# Altium schematic sheet QTR-8A Array Sensor.SchDoc
size A; SheetNumber: 1; SheetTotal: 1
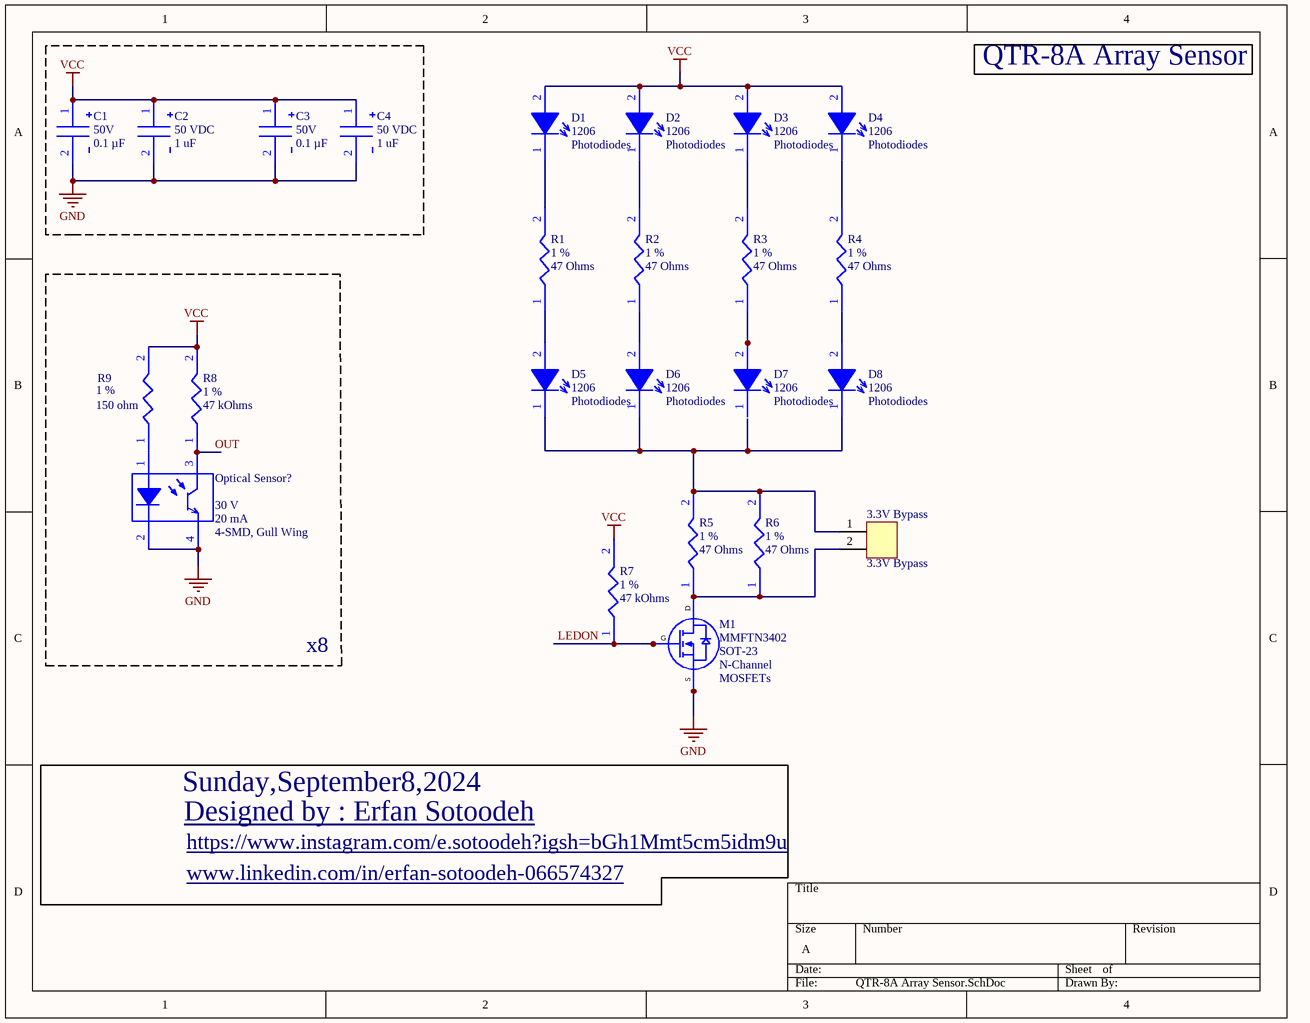
[diagram p0: QTR-8A Array Sensor.SchDoc]

## Parts
3.3V_Bypass  3.3V Bypass  [3.3V Bypass]
C1  Voltage - Rated: 50V  Capacitance: 0.1 µF  [CL21B104KBCNNNC]  (hidden comment: CL21B104KBCNNNC)
C2  Voltage - Rated: 50 VDC  Capacitance: 1 uF  [C1206X105K5RAC7800]  (hidden comment: C1206X105K5RAC)
C3  Voltage - Rated: 50V  Capacitance: 0.1 µF  [CL21B104KBCNNNC]  (hidden comment: CL21B104KBCNNNC)
C4  Voltage - Rated: 50 VDC  Capacitance: 1 uF  [C1206X105K5RAC7800]  (hidden comment: C1206X105K5RAC)
D1  Package/Case: 1206  Product: Photodiodes  [1541201EEA400]  (hidden comment: 1541201EEA400)
D2  Package/Case: 1206  Product: Photodiodes  [1541201EEA400]  (hidden comment: 1541201EEA400)
D3  Package/Case: 1206  Product: Photodiodes  [1541201EEA400]  (hidden comment: 1541201EEA400)
D4  Package/Case: 1206  Product: Photodiodes  [1541201EEA400]  (hidden comment: 1541201EEA400)
D5  Package/Case: 1206  Product: Photodiodes  [1541201EEA400]  (hidden comment: 1541201EEA400)
D6  Package/Case: 1206  Product: Photodiodes  [1541201EEA400]  (hidden comment: 1541201EEA400)
D7  Package/Case: 1206  Product: Photodiodes  [1541201EEA400]  (hidden comment: 1541201EEA400)
D8  Package/Case: 1206  Product: Photodiodes  [1541201EEA400]  (hidden comment: 1541201EEA400)
M1  MMFTN3402  Package/Case:: SOT-23  Transistor Polarity:: N-Channel  Product Category:: MOSFETs  [SOT95P245X110-3N]
Optical_Sensor?  Voltage - Collector Emitter Breakdown (Max: 30 V  Current - Collector (Ic) (Max): 20 mA  Package/Case:: 4-SMD, Gull Wing  [QRE1113GR]  (hidden comment: qre1113gr)
R1  Tolerance: 1 %  Resistance: 47 Ohms  [ERJ-S08F47R0V]  (hidden comment: ERJ-S08F47R0V)
R2  Tolerance: 1 %  Resistance: 47 Ohms  [ERJ-S08F47R0V]  (hidden comment: ERJ-S08F47R0V)
R3  Tolerance: 1 %  Resistance: 47 Ohms  [ERJ-S08F47R0V]  (hidden comment: ERJ-S08F47R0V)
R4  Tolerance: 1 %  Resistance: 47 Ohms  [ERJ-S08F47R0V]  (hidden comment: ERJ-S08F47R0V)
R5  Tolerance: 1 %  Resistance: 47 Ohms  [ERJ-S08F47R0V]  (hidden comment: ERJ-S08F47R0V)
R6  Tolerance: 1 %  Resistance: 47 Ohms  [ERJ-S08F47R0V]  (hidden comment: ERJ-S08F47R0V)
R7  Tolerance: 1 %  Resistance: 47 kOhms  [ERJ-U08F4702V]  (hidden comment: ERJ-U08F4702V)
R8  Tolerance: 1 %  Resistance: 47 kOhms  [ERJ-U08F4702V]  (hidden comment: ERJ-U08F4702V)
R9  Tolerance: 1 %  Resistance: 150 ohm  [ERJ-S08F47R0V]  (hidden comment: ERJ-8ENF1500V)

## Blocks framed on the sheet
x8: Optical_Sensor? R8 R9

## Nets
GND: C1.2 C2.2 C3.2 C4.2 M1.S Optical_Sensor?.2 Optical_Sensor?.4
VCC: C1.1(+) C2.1(+) C3.1(+) C4.1(+) D1.2 D2.2 D3.2 D4.2 R7.2 R8.2 R9.2
LEDON: M1.G R7.1
OUT: Optical_Sensor?.3 R8.1
Net3.3V_Bypass_1: 3.3V_Bypass.1 D5.1 D6.1 D8.1 R5.2 R6.2
Net3.3V_Bypass_2: 3.3V_Bypass.2 M1.D R5.1 R6.1
NetD1_1: D1.1 R1.2
NetD2_1: D2.1 R2.2
NetD3_1: D3.1 R3.2
NetD4_1: D4.1 R4.2
NetD5_2: D5.2 R1.1
NetD6_2: D6.2 R2.1
NetD7_2: D7.2 R3.1
NetD8_2: D8.2 R4.1
NetOptical_Sensor?_1: Optical_Sensor?.1 R9.1

Not connected (* = marked no-connect by the designer): D7 1; M1 1 2

## Notes on the sheet
- QTR-8A Array Sensor
- Sunday,September8,2024
- Designed by : Erfan Sotoodeh <https://www.instagram.com/e.sotoodeh?igsh=bGh1Mmt5cm5idm9u>
- https://www.instagram.com/e.sotoodeh?igsh=bGh1Mmt5cm5idm9u
- www.linkedin.com/in/erfan-sotoodeh-066574327 <http://www.linkedin.com/in/erfan-sotoodeh-066574327>

## Library data of the parts
C1 C3 = CL21B104KBCNNNC: 0.1 µF ±10% 50V Ceramic Capacitor X7R 0805 (2012 Metric); VALUE: 0.1 µF; Mounting Type: Surface Mount, MLCC; Package / Case: 0805
C2 C4 = C1206X105K5RAC: Multilayer Ceramic Capacitors MLCC - SMD/SMT 50V 1uF X7R 1206 10%; Mounting Type: Surface Mount Multilayer Ceramic Chip Capacitor; Package / Case: 1206; VALUE: 1 uF
D1-D8 = 1541201EEA400: Photodiodes WL-SDCB SMT Photodiode Chip Blk; Voltage: 32 V; Mounting Style: SMD/SMT
M1 = MMFTN3402: MOSFETs MOSFET, SOT-23, 30V, 4A, 150C, N; Mounting Style:: SMD/SMT; Number of Channels:: 1 Channel; Vgs: - 12 V, + 12 V; Subcategory:: Transistors; Id: 4 A; Vds: 30 V
Optical_Sensor? = qre1113gr: SENSOR OPTO TRANS REFL SMD PHOTO; Manufacturer: onsemi; Mounting Style:: SMD/SMT; Output Type: Phototransistor; Current - DC Forward (If) (Max): 50 mA; Category: Sensors, Transducers,Optical Sensors
R1-R6 = ERJ-S08F47R0V: Thick Film Resistors - SMD 1206 47ohms 1% Anti-Sulfur; Manufacturer:: Panasonic; Case: 1206; Mounting Style: PCB Mount; VALUE: 47 Ohms
R7 R8 = ERJ-U08F4702V: Thick Film Resistors - SMD 1206 1% 47Kohm Anti-Sulfur AEC-Q200; Manufacturer:: Panasonic; VALUE: 47 kOhms; Case: 1206; Mounting Style: PCB Mount
R9 = ERJ-8ENF1500V: Thick Film Resistors - SMD 1206 150ohms 1% AEC-Q200; Manufacturer:: Panasonic; Value: 150 ohm; Case: 1206; Mounting Style: PCB Mount